# Altium schematic sheet Sheet2.SchDoc
size A
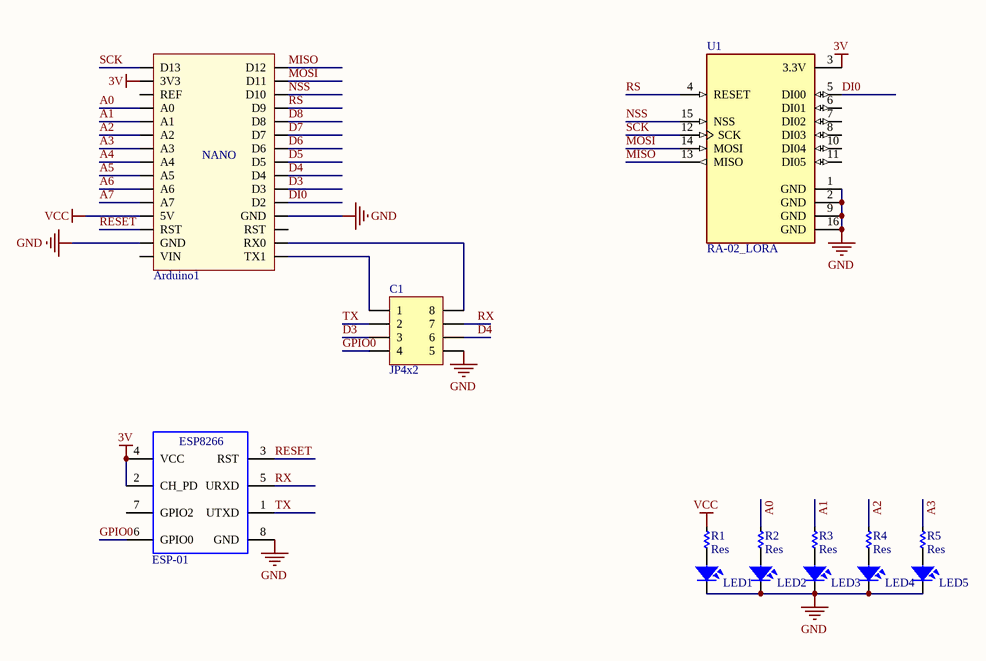
[diagram p0: Sheet2.SchDoc]

## Parts
Arduino1  Arduino Nano  [Arduino Nano]  (value not drawn)
C1  JP4x2  [JP4-D2T]
LED1  LED  [LED-5-Yellow]  (value not drawn)
LED2  LED  [LED-5-Yellow]  (value not drawn)
LED3  LED  [LED-5-Yellow]  (value not drawn)
LED4  LED  [LED-5-Yellow]  (value not drawn)
LED5  LED  [LED-5-Yellow]  (value not drawn)
R1  Res  [RES-1/4WD]
R2  Res  [RES-1/4WD]
R3  Res  [RES-1/4WD]
R4  Res  [RES-1/4WD]
R5  Res  [RES-1/4WD]
U1  RA-02_LORA  [MODULE_RA-02_LORA]
U2  ESP-01  [ESP8266]

## Nets
3V: Arduino1.3V3 U1.3(3.3V) U2.2(CH_PD) U2.4(VCC)
GND: Arduino1.GND C1.5 LED1.2 LED2.2 LED3.2 LED4.2 LED5.2 U1.1(GND) U1.2(GND) U1.9(GND) U1.16(GND) U2.8(GND)
VCC: Arduino1.5V R1.1
A0: Arduino1.A0 R2.1
A1: Arduino1.A1 R3.1
A2: Arduino1.A2 R4.1
A3: Arduino1.A3 R5.1
A4: Arduino1.A4
A5: Arduino1.A5
A6: Arduino1.A6
A7: Arduino1.A7
D3: Arduino1.D3 C1.3
D4: Arduino1.D4 C1.6
D5: Arduino1.D5
D6: Arduino1.D6
D7: Arduino1.D7
D8: Arduino1.D8
DI0: Arduino1.D2 U1.5(DI00)
GPIO0: C1.4 U2.6(GPIO0)
MISO: Arduino1.D12 U1.13(MISO)
MOSI: Arduino1.D11 U1.14(MOSI)
NSS: Arduino1.D10 U1.15(NSS)
RESET: Arduino1.RST U2.3(RST)
RS: Arduino1.D9 U1.4(RESET)
RX: C1.7 U2.5(URXD)
SCK: Arduino1.D13 U1.12(SCK)
TX: C1.2 U2.1(UTXD)
NetArduino1_RX0: Arduino1.RX0 C1.8
NetArduino1_TX1: Arduino1.TX1 C1.1
NetLED1_1: LED1.1 R1.2
NetLED2_1: LED2.1 R2.2
NetLED3_1: LED3.1 R3.2
NetLED4_1: LED4.1 R4.2
NetLED5_1: LED5.1 R5.2

Not connected (* = marked no-connect by the designer): Arduino1 REF VIN; U1 6(DI01) 7(DI02) 8(DI03) 10(DI04) 11(DI05); U2 7(GPIO2)

## Notes on the sheet
- (in symbol Arduino Nano) NANO
- (in symbol ESP8266-01) ESP8266

## Library data of the parts
Arduino1 = Arduino Nano: Value: Cau 1A
C1 = JP4x2: WR-PHD 2.54 mm Dual Socket Header; Manufacturer: W¨¹rth Elektronik eiSos GmbH; partNo: 61300821821; ComponentLink1 Description: Manufacturer; ComponentLink2 Description: Datasheet; NoPins: 08; Created Date: 29 March 2013; ComponentLink1URL: http://www.we-online.com; ComponentLink2URL: http://katalog.we-online.de/em/datasheet/6130xx21821.pdf; Created by: Karrer Zheng
LED1-LED5 = LED: LED Single colour Green and Red; Value: LED 3 ly Single Colour
R1-R5 = Res: Manufacturer: Generic Components; Class: Passive; SubClass: R; Published: 08/06/2000; Publisher: Altium Hobart Technology Centre
U1 = RA-02_LORA: Ra-02 LoRa RF M5Stack Platform Evaluation Expansion Board; MF: AI-Thinker; Package: Package; Availability: Unavailable; Value: *; MP: Ra-02 LoRa; Check_prices: https://www.snapeda.com/parts/Ra-02%20LoRa/AI-Thinker/view-part/4449259/?ref=eda; SnapEDA_Link: https://www.snapeda.com/parts/Ra-02%20LoRa/AI-Thinker/view-part/4449259/?ref=snap; Price: None
U2 = ESP8266-01: ESP-12 Wi-Fi Module